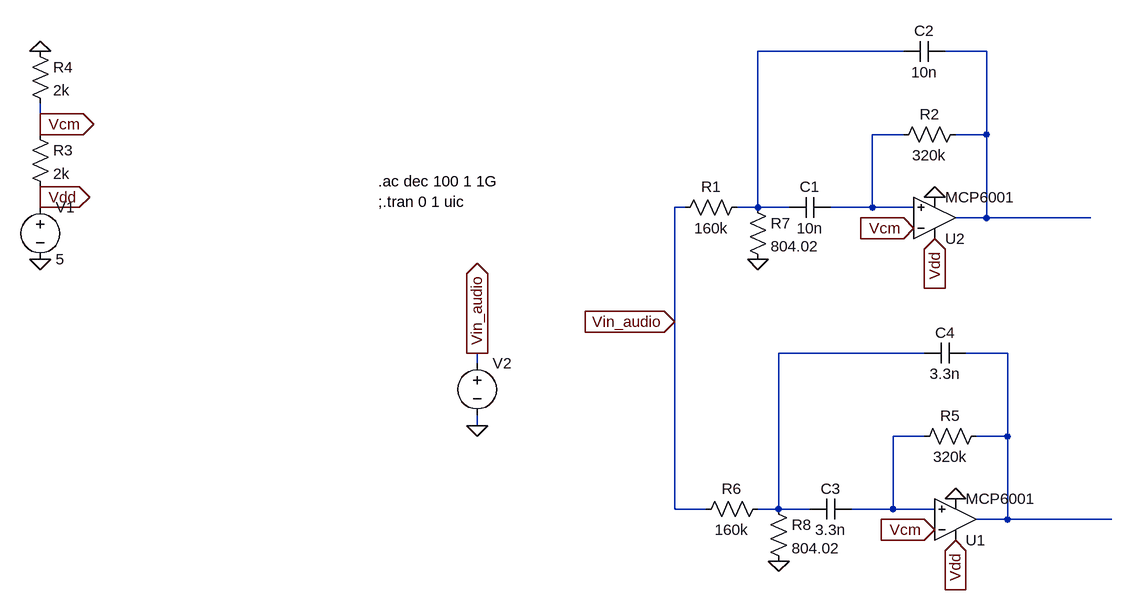
[diagram p0: schematic Exp6_final.asc]
Exp6_final.asc, the LTspice schematic file:
Version 4.1
SHEET 1 880 680
WIRE 64 -432 -160 -432
WIRE 192 -432 128 -432
WIRE -1264 -320 -1264 -352
WIRE -1264 -304 -1264 -320
WIRE 64 -304 16 -304
WIRE 192 -304 192 -432
WIRE 192 -304 144 -304
WIRE -1264 -208 -1264 -224
WIRE -1264 -192 -1264 -208
WIRE -272 -192 -288 -192
WIRE -160 -192 -160 -432
WIRE -160 -192 -192 -192
WIRE -112 -192 -160 -192
WIRE 16 -192 16 -304
WIRE 16 -192 -48 -192
WIRE 80 -192 16 -192
WIRE 192 -176 192 -304
WIRE 192 -176 144 -176
WIRE 352 -176 192 -176
WIRE -288 -16 -288 -192
WIRE 96 32 -128 32
WIRE 224 32 160 32
WIRE -592 48 -592 32
WIRE -592 144 -592 128
WIRE 96 160 48 160
WIRE 224 160 224 32
WIRE 224 160 176 160
WIRE -288 272 -288 -16
WIRE -240 272 -288 272
WIRE -128 272 -128 32
WIRE -128 272 -160 272
WIRE -80 272 -128 272
WIRE 48 272 48 160
WIRE 48 272 -16 272
WIRE 112 272 48 272
WIRE 224 288 224 160
WIRE 224 288 176 288
WIRE 384 288 224 288
FLAG -1264 -112 0
FLAG -1264 -432 0
FLAG -1264 -208 Vdd
IOPIN -1264 -208 Out
FLAG -1264 -320 Vcm
IOPIN -1264 -320 Out
FLAG 112 -208 0
FLAG 144 256 0
FLAG -128 352 0
FLAG -160 -112 0
FLAG -592 32 Vin_audio
IOPIN -592 32 Out
FLAG -592 144 0
FLAG -288 -16 Vin_audio
IOPIN -288 -16 In
FLAG 80 -160 Vcm
IOPIN 80 -160 In
FLAG 112 304 Vcm
IOPIN 112 304 In
FLAG 144 320 Vdd
IOPIN 144 320 In
FLAG 112 -144 Vdd
IOPIN 112 -144 In
SYMBOL MCP6001 112 -176 M180
SYMATTR InstName U2
SYMBOL res 160 -320 R90
WINDOW 0 0 56 VBottom 2
WINDOW 3 32 56 VTop 2
SYMATTR InstName R2
SYMATTR Value 320k
SYMBOL cap -48 -208 R90
WINDOW 0 0 32 VBottom 2
WINDOW 3 32 32 VTop 2
SYMATTR InstName C1
SYMATTR Value 10n
SYMBOL cap 128 -448 R90
WINDOW 0 0 32 VBottom 2
WINDOW 3 32 32 VTop 2
SYMATTR InstName C2
SYMATTR Value 10n
SYMBOL res -176 -208 R90
WINDOW 0 0 56 VBottom 2
WINDOW 3 32 56 VTop 2
SYMATTR InstName R1
SYMATTR Value 160k
SYMBOL voltage -1264 -208 R0
WINDOW 123 0 0 Left 0
WINDOW 39 0 0 Left 0
SYMATTR InstName V1
SYMATTR Value 5
SYMBOL res -1280 -320 R0
SYMATTR InstName R3
SYMATTR Value 2k
SYMBOL res -1280 -448 R0
SYMATTR InstName R4
SYMATTR Value 2k
SYMBOL MCP6001 144 288 M180
SYMATTR InstName U1
SYMBOL res 192 144 R90
WINDOW 0 0 56 VBottom 2
WINDOW 3 32 56 VTop 2
SYMATTR InstName R5
SYMATTR Value 320k
SYMBOL cap -16 256 R90
WINDOW 0 0 32 VBottom 2
WINDOW 3 32 32 VTop 2
SYMATTR InstName C3
SYMATTR Value 3.3n
SYMBOL cap 160 16 R90
WINDOW 0 0 32 VBottom 2
WINDOW 3 32 32 VTop 2
SYMATTR InstName C4
SYMATTR Value 3.3n
SYMBOL res -144 256 R90
WINDOW 0 0 56 VBottom 2
WINDOW 3 32 56 VTop 2
SYMATTR InstName R6
SYMATTR Value 160k
SYMBOL res -176 -208 R0
SYMATTR InstName R7
SYMATTR Value 804.02
SYMBOL res -144 256 R0
SYMATTR InstName R8
SYMATTR Value 804.02
SYMBOL voltage -592 32 R0
WINDOW 3 82 38 Invisible 1
WINDOW 39 0 0 Left 0
SYMATTR Value SINE(0 0.45 3.3k)
SYMATTR InstName V2
SYMATTR Value2 AC 1 0
TEXT -744 -232 Left 2 !.ac dec 100 1 1G\n;.tran 0 1 uic

The netlist it stands for:
* Exp6_final.asc
* U2: MCP6001 (symbol MCP6001 not available, pins judged from their places): In+=N003 In-=Vcm V+=Vdd V-=0 OUT=N002
R2 N002 N003 320k
C1 N003 N001 10n
C2 N002 N001 10n
R1 N001 Vin_audio 160k
V1 Vdd 0 5
R3 Vcm Vdd 2k
R4 0 Vcm 2k
* U1: MCP6001 (symbol MCP6001 not available, pins judged from their places): In+=N006 In-=Vcm V+=Vdd V-=0 OUT=N005
R5 N005 N006 320k
C3 N006 N004 3.3n
C4 N005 N004 3.3n
R6 N004 Vin_audio 160k
R7 N001 0 804.02
R8 N004 0 804.02
V2 Vin_audio 0 SINE(0 0.45 3.3k) AC 1 0
.ac dec 100 1 1G
;.tran 0 1 uic
.backanno
.end